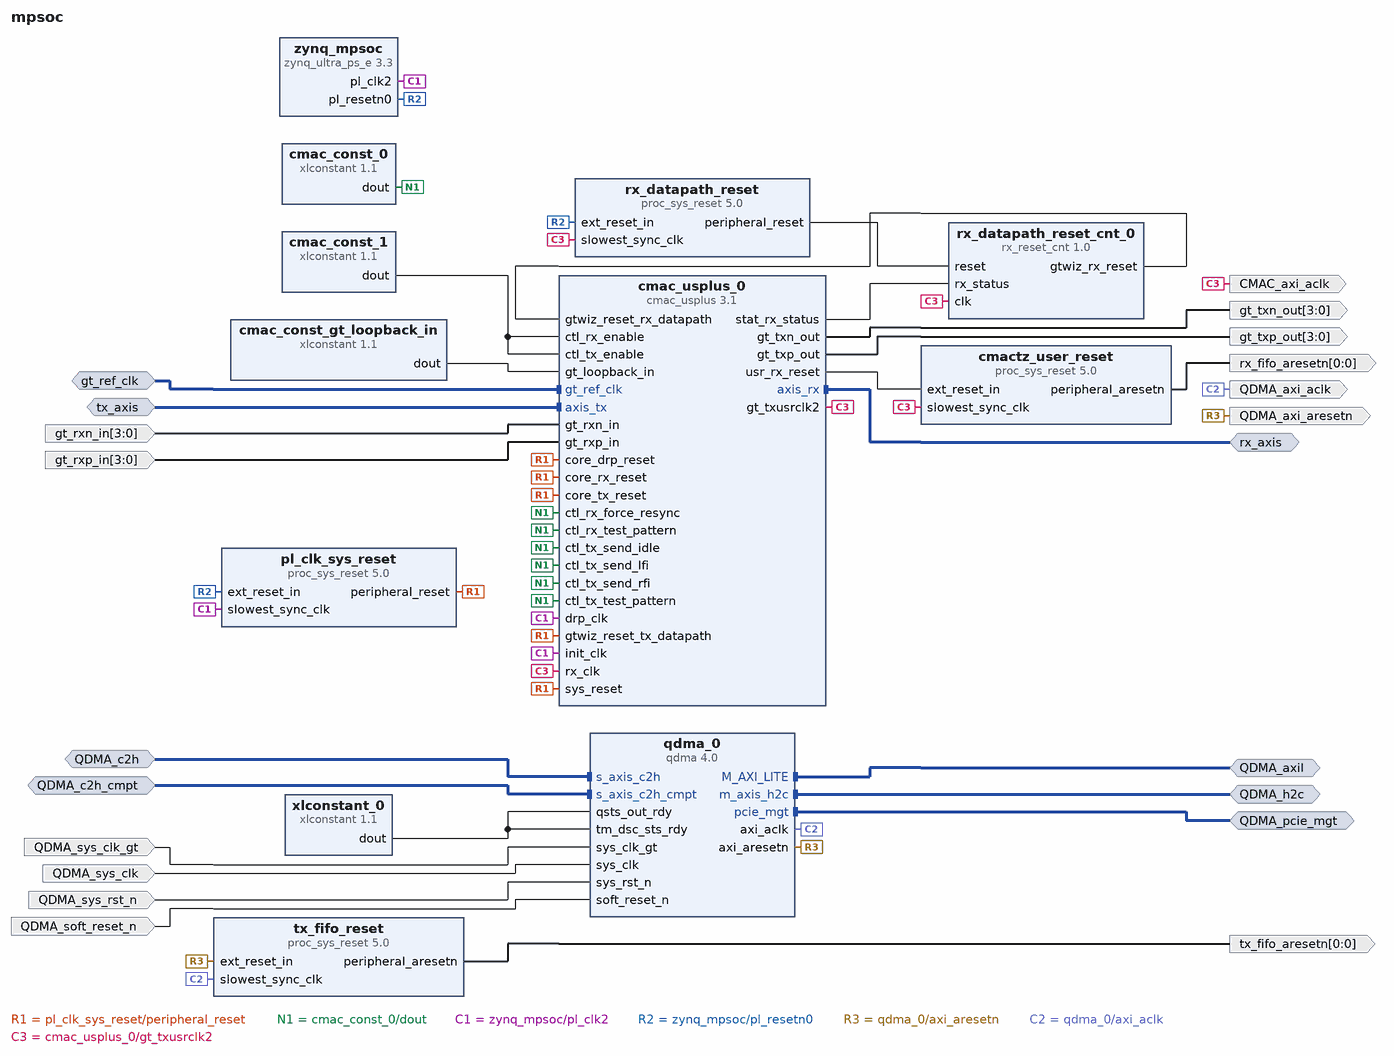
[diagram p0: block diagram of the top level]
# Vivado block design mpsoc, xczu19eg-ffvc1760-2-e, Vivado 2020.1
create_bd_design mpsoc

create_bd_intf_port -mode Slave -vlnv xilinx.com:interface:diff_clock_rtl:1.0 gt_ref_clk
set_property -dict {CONFIG.FREQ_HZ 156250000} [get_bd_intf_ports gt_ref_clk]
create_bd_intf_port -mode Master -vlnv xilinx.com:interface:pcie_7x_mgt_rtl:1.0 QDMA_pcie_mgt
create_bd_intf_port -mode Master -vlnv xilinx.com:display_eqdma:m_axis_h2c_rtl:1.0 QDMA_h2c
create_bd_intf_port -mode Slave -vlnv xilinx.com:display_eqdma:s_axis_c2h_rtl:1.0 QDMA_c2h
create_bd_intf_port -mode Slave -vlnv xilinx.com:display_eqdma:s_axis_c2h_cmpt_rtl:1.0 QDMA_c2h_cmpt
create_bd_intf_port -mode Master -vlnv xilinx.com:interface:aximm_rtl:1.0 QDMA_axil
set_property -dict [list \
  CONFIG.DATA_WIDTH 32 \
  CONFIG.PROTOCOL AXI4LITE \
  CONFIG.FREQ_HZ 250000000 \
  CONFIG.ADDR_WIDTH 32 \
  CONFIG.HAS_BURST 0 \
  CONFIG.HAS_LOCK 0 \
  CONFIG.HAS_CACHE 0 \
  CONFIG.HAS_QOS 0 \
  CONFIG.HAS_REGION 0 \
] [get_bd_intf_ports QDMA_axil]
create_bd_intf_port -mode Master -vlnv xilinx.com:interface:axis_rtl:1.0 rx_axis
set_property -dict {CONFIG.FREQ_HZ 322265625} [get_bd_intf_ports rx_axis]
create_bd_intf_port -mode Slave -vlnv xilinx.com:interface:axis_rtl:1.0 tx_axis
set_property -dict [list \
  CONFIG.TDATA_NUM_BYTES 64 \
  CONFIG.TDEST_WIDTH 0 \
  CONFIG.TID_WIDTH 0 \
  CONFIG.TUSER_WIDTH 1 \
  CONFIG.HAS_TREADY 1 \
  CONFIG.HAS_TSTRB 0 \
  CONFIG.HAS_TKEEP 1 \
  CONFIG.HAS_TLAST 1 \
  CONFIG.LAYERED_METADATA undef \
] [get_bd_intf_ports tx_axis]
create_bd_port -dir I -from 3 -to 0 gt_rxn_in
create_bd_port -dir I -from 3 -to 0 gt_rxp_in
create_bd_port -dir O -from 3 -to 0 gt_txn_out
create_bd_port -dir O -from 3 -to 0 gt_txp_out
create_bd_port -dir I -type clk QDMA_sys_clk_gt
create_bd_port -dir I -type clk QDMA_sys_clk
set_property -dict {CONFIG.ASSOCIATED_RESET QDMA_sys_rst_n} [get_bd_ports QDMA_sys_clk]
create_bd_port -dir I -type rst QDMA_sys_rst_n
create_bd_port -dir O -type rst QDMA_axi_aresetn
create_bd_port -dir O -type clk QDMA_axi_aclk
set_property -dict {CONFIG.ASSOCIATED_BUSIF QDMA_axil CONFIG.FREQ_HZ 250000000} [get_bd_ports QDMA_axi_aclk]
create_bd_port -dir I -type rst QDMA_soft_reset_n
create_bd_port -dir O -type clk CMAC_axi_aclk
set_property -dict {CONFIG.ASSOCIATED_BUSIF tx_axis} [get_bd_ports CMAC_axi_aclk]
create_bd_port -dir O -from 0 -to 0 -type rst rx_fifo_aresetn
create_bd_port -dir O -from 0 -to 0 -type rst tx_fifo_aresetn

create_bd_cell -type ip -vlnv xilinx.com:ip:xlconstant:1.1 cmac_const_0
set_property -dict {CONFIG.CONST_VAL 0} [get_bd_cells cmac_const_0]
create_bd_cell -type ip -vlnv xilinx.com:ip:xlconstant:1.1 cmac_const_1
set_property -dict {CONFIG.CONST_VAL 1} [get_bd_cells cmac_const_1]
create_bd_cell -type ip -vlnv xilinx.com:ip:xlconstant:1.1 cmac_const_gt_loopback_in
set_property -dict {CONFIG.CONST_VAL 0 CONFIG.CONST_WIDTH 12} [get_bd_cells cmac_const_gt_loopback_in]
create_bd_cell -type ip -vlnv xilinx.com:ip:cmac_usplus:3.1 cmac_usplus_0
set_property -dict [list \
  CONFIG.CMAC_CAUI4_MODE 1 \
  CONFIG.CMAC_CORE_SELECT CMACE4_X0Y1 \
  CONFIG.ENABLE_AXI_INTERFACE 0 \
  CONFIG.GT_GROUP_SELECT {X0Y12~X0Y15} \
  CONFIG.GT_REF_CLK_FREQ 156.25 \
  CONFIG.NUM_LANES 4x25 \
  CONFIG.RX_FLOW_CONTROL 0 \
  CONFIG.RX_FRAME_CRC_CHECKING {Enable FCS Stripping} \
  CONFIG.RX_MAX_PACKET_LEN 2048 \
  CONFIG.TX_FLOW_CONTROL 0 \
  CONFIG.TX_FRAME_CRC_CHECKING {Enable FCS Insertion} \
  CONFIG.USER_INTERFACE AXIS \
] [get_bd_cells cmac_usplus_0]
create_bd_cell -type ip -vlnv xilinx.com:ip:proc_sys_reset:5.0 pl_clk_sys_reset
create_bd_cell -type ip -vlnv xilinx.com:ip:proc_sys_reset:5.0 rx_datapath_reset
create_bd_cell -type ip -vlnv user.org:user:rx_reset_cnt:1.0 rx_datapath_reset_cnt_0
create_bd_cell -type ip -vlnv xilinx.com:ip:proc_sys_reset:5.0 cmactz_user_reset
create_bd_cell -type ip -vlnv xilinx.com:ip:zynq_ultra_ps_e:3.3 zynq_mpsoc
set_property -dict [list \
  CONFIG.PSU_BANK_0_IO_STANDARD LVCMOS33 \
  CONFIG.PSU_BANK_1_IO_STANDARD LVCMOS33 \
  CONFIG.PSU_BANK_2_IO_STANDARD LVCMOS33 \
  CONFIG.PSU__CRF_APB__DDR_CTRL__FREQMHZ 1067 \
  CONFIG.PSU__CRL_APB__PL2_REF_CTRL__SRCSEL DPLL \
  CONFIG.PSU__DDRC__COMPONENTS UDIMM \
  CONFIG.PSU__DDRC__DEVICE_CAPACITY {8192 MBits} \
  CONFIG.PSU__DDRC__SPEED_BIN DDR4_2133P \
  CONFIG.PSU__DDR_HIGH_ADDRESS_GUI_ENABLE 1 \
  CONFIG.PSU__DDR__INTERFACE__FREQMHZ 533.500 \
  CONFIG.PSU__DLL__ISUSED 1 \
  CONFIG.PSU__ENET0__GRP_MDIO__ENABLE 1 \
  CONFIG.PSU__ENET0__GRP_MDIO__IO {MIO 76 .. 77} \
  CONFIG.PSU__ENET0__PERIPHERAL__ENABLE 1 \
  CONFIG.PSU__ENET0__PERIPHERAL__IO {MIO 26 .. 37} \
  CONFIG.PSU__ENET1__PERIPHERAL__ENABLE 1 \
  CONFIG.PSU__ENET1__PERIPHERAL__IO {GT Lane1} \
  CONFIG.PSU__EXPAND__LOWER_LPS_SLAVES 1 \
  CONFIG.PSU__FPGA_PL0_ENABLE 0 \
  CONFIG.PSU__FPGA_PL2_ENABLE 1 \
  CONFIG.PSU__GEM1__REF_CLK_FREQ 125 \
  CONFIG.PSU__GEM1__REF_CLK_SEL {Ref Clk1} \
  CONFIG.PSU__GEM__TSU__ENABLE 0 \
  CONFIG.PSU__OVERRIDE__BASIC_CLOCK 0 \
  CONFIG.PSU__PSS_REF_CLK__FREQMHZ 50 \
  CONFIG.PSU__QSPI_COHERENCY 0 \
  CONFIG.PSU__QSPI_ROUTE_THROUGH_FPD 0 \
  CONFIG.PSU__QSPI__GRP_FBCLK__ENABLE 0 \
  CONFIG.PSU__QSPI__PERIPHERAL__DATA_MODE x4 \
  CONFIG.PSU__QSPI__PERIPHERAL__ENABLE 1 \
  CONFIG.PSU__QSPI__PERIPHERAL__IO {MIO 0 .. 12} \
  CONFIG.PSU__QSPI__PERIPHERAL__MODE {Dual Parallel} \
  CONFIG.PSU__SD0__DATA_TRANSFER_MODE 4Bit \
  CONFIG.PSU__SD0__PERIPHERAL__ENABLE 1 \
  CONFIG.PSU__SD0__PERIPHERAL__IO {MIO 13 .. 16 21 22} \
  CONFIG.PSU__SD0__SLOT_TYPE {SD 2.0} \
  CONFIG.PSU__TSU__BUFG_PORT_PAIR 0 \
  CONFIG.PSU__UART0__BAUD_RATE 115200 \
  CONFIG.PSU__UART0__MODEM__ENABLE 0 \
  CONFIG.PSU__UART0__PERIPHERAL__ENABLE 1 \
  CONFIG.PSU__UART0__PERIPHERAL__IO {MIO 46 .. 47} \
  CONFIG.PSU__USE__IRQ0 1 \
  CONFIG.PSU__USE__M_AXI_GP0 0 \
  CONFIG.PSU__USE__M_AXI_GP1 0 \
  CONFIG.PSU__USE__M_AXI_GP2 0 \
  CONFIG.SUBPRESET1 Custom \
] [get_bd_cells zynq_mpsoc]
# 69 more settings of zynq_mpsoc are not shown: defaults, MIO pin electricals, DDR timing, and values the tool derives
create_bd_cell -type ip -vlnv xilinx.com:ip:qdma:4.0 qdma_0
set_property -dict [list \
  CONFIG.dma_intf_sel_qdma AXI_Stream_with_Completion \
  CONFIG.en_axi_mm_qdma false \
  CONFIG.en_axi_st_qdma true \
  CONFIG.num_queues 2048 \
  CONFIG.pcie_blk_locn X1Y0 \
  CONFIG.pf3_subsystem_id 0007 \
  CONFIG.testname st \
  CONFIG.tl_pf_enable_reg 1 \
] [get_bd_cells qdma_0]
create_bd_cell -type ip -vlnv xilinx.com:ip:proc_sys_reset:5.0 tx_fifo_reset
create_bd_cell -type ip -vlnv xilinx.com:ip:xlconstant:1.1 xlconstant_0

# ---- connections ----

connect_bd_intf_net [get_bd_intf_ports QDMA_h2c] [get_bd_intf_pins qdma_0/m_axis_h2c]
connect_bd_intf_net -intf_net gt_ref_clk_0_1 [get_bd_intf_ports gt_ref_clk] [get_bd_intf_pins cmac_usplus_0/gt_ref_clk]
connect_bd_intf_net [get_bd_intf_ports QDMA_axil] [get_bd_intf_pins qdma_0/M_AXI_LITE]
connect_bd_intf_net [get_bd_intf_ports rx_axis] [get_bd_intf_pins cmac_usplus_0/axis_rx]
connect_bd_intf_net -intf_net s_axis_c2h_0_1 [get_bd_intf_ports QDMA_c2h] [get_bd_intf_pins qdma_0/s_axis_c2h]
connect_bd_intf_net -intf_net axis_tx_0_1 [get_bd_intf_ports tx_axis] [get_bd_intf_pins cmac_usplus_0/axis_tx]
connect_bd_intf_net [get_bd_intf_ports QDMA_pcie_mgt] [get_bd_intf_pins qdma_0/pcie_mgt]
connect_bd_intf_net -intf_net s_axis_c2h_cmpt_0_1 [get_bd_intf_ports QDMA_c2h_cmpt] [get_bd_intf_pins qdma_0/s_axis_c2h_cmpt]
connect_bd_net -net axi_ic_if_reset [get_bd_pins pl_clk_sys_reset/peripheral_reset] \
  [get_bd_pins cmac_usplus_0/core_drp_reset] [get_bd_pins cmac_usplus_0/core_rx_reset] \
  [get_bd_pins cmac_usplus_0/core_tx_reset] [get_bd_pins cmac_usplus_0/gtwiz_reset_tx_datapath] \
  [get_bd_pins cmac_usplus_0/sys_reset]
connect_bd_net [get_bd_pins cmac_usplus_0/gt_txn_out] [get_bd_ports gt_txn_out]
connect_bd_net [get_bd_pins cmac_usplus_0/gt_txp_out] [get_bd_ports gt_txp_out]
connect_bd_net [get_bd_pins cmac_usplus_0/usr_rx_reset] [get_bd_pins cmactz_user_reset/ext_reset_in]
connect_bd_net -net const_0_dout [get_bd_pins cmac_const_0/dout] \
  [get_bd_pins cmac_usplus_0/ctl_rx_force_resync] [get_bd_pins cmac_usplus_0/ctl_rx_test_pattern] \
  [get_bd_pins cmac_usplus_0/ctl_tx_send_idle] [get_bd_pins cmac_usplus_0/ctl_tx_send_lfi] \
  [get_bd_pins cmac_usplus_0/ctl_tx_send_rfi] [get_bd_pins cmac_usplus_0/ctl_tx_test_pattern]
connect_bd_net -net const_1_dout [get_bd_pins cmac_const_1/dout] [get_bd_pins cmac_usplus_0/ctl_rx_enable] [get_bd_pins cmac_usplus_0/ctl_tx_enable]
connect_bd_net -net const_gt_loopback_in_dout [get_bd_pins cmac_const_gt_loopback_in/dout] [get_bd_pins cmac_usplus_0/gt_loopback_in]
connect_bd_net -net doce_ic_reset_peripheral_reset [get_bd_pins rx_datapath_reset/peripheral_reset] [get_bd_pins rx_datapath_reset_cnt_0/reset]
connect_bd_net [get_bd_ports gt_rxn_in] [get_bd_pins cmac_usplus_0/gt_rxn_in]
connect_bd_net [get_bd_ports gt_rxp_in] [get_bd_pins cmac_usplus_0/gt_rxp_in]
connect_bd_net -net pl_clk2_out [get_bd_pins zynq_mpsoc/pl_clk2] \
  [get_bd_pins cmac_usplus_0/drp_clk] [get_bd_pins cmac_usplus_0/init_clk] [get_bd_pins pl_clk_sys_reset/slowest_sync_clk]
connect_bd_net -net pl_resetn0 [get_bd_pins zynq_mpsoc/pl_resetn0] \
  [get_bd_pins pl_clk_sys_reset/ext_reset_in] [get_bd_pins rx_datapath_reset/ext_reset_in]
connect_bd_net -net rx_reset_cnt_0_gtwiz_rx_reset [get_bd_pins rx_datapath_reset_cnt_0/gtwiz_rx_reset] \
  [get_bd_pins cmac_usplus_0/gtwiz_reset_rx_datapath]
connect_bd_net -net sys_clk_gt_0_1 [get_bd_ports QDMA_sys_clk_gt] [get_bd_pins qdma_0/sys_clk_gt]
connect_bd_net -net sys_clk_0_1 [get_bd_ports QDMA_sys_clk] [get_bd_pins qdma_0/sys_clk]
connect_bd_net -net sys_rst_n_0_1 [get_bd_ports QDMA_sys_rst_n] [get_bd_pins qdma_0/sys_rst_n]
connect_bd_net [get_bd_pins qdma_0/axi_aresetn] [get_bd_ports QDMA_axi_aresetn] [get_bd_pins tx_fifo_reset/ext_reset_in]
connect_bd_net [get_bd_pins qdma_0/axi_aclk] [get_bd_ports QDMA_axi_aclk] [get_bd_pins tx_fifo_reset/slowest_sync_clk]
connect_bd_net -net tx_reset_peripheral_aresetn [get_bd_pins cmactz_user_reset/peripheral_aresetn] [get_bd_ports rx_fifo_aresetn]
connect_bd_net -net soft_reset_n_0_1 [get_bd_ports QDMA_soft_reset_n] [get_bd_pins qdma_0/soft_reset_n]
connect_bd_net [get_bd_pins cmac_usplus_0/gt_txusrclk2] \
  [get_bd_pins cmac_usplus_0/rx_clk] [get_bd_pins rx_datapath_reset/slowest_sync_clk] \
  [get_bd_pins cmactz_user_reset/slowest_sync_clk] [get_bd_pins rx_datapath_reset_cnt_0/clk] [get_bd_ports CMAC_axi_aclk]
connect_bd_net -net rx_datapath_reset1_peripheral_aresetn [get_bd_pins tx_fifo_reset/peripheral_aresetn] [get_bd_ports tx_fifo_aresetn]
connect_bd_net [get_bd_pins xlconstant_0/dout] [get_bd_pins qdma_0/qsts_out_rdy] [get_bd_pins qdma_0/tm_dsc_sts_rdy]
connect_bd_net [get_bd_pins cmac_usplus_0/stat_rx_status] [get_bd_pins rx_datapath_reset_cnt_0/rx_status]

# ---- address map ----
assign_bd_address -offset 0x44A00000 -range 64K -target_address_space [get_bd_addr_spaces qdma_0/M_AXI_LITE] [get_bd_addr_segs QDMA_axil/Reg]

validate_bd_design
save_bd_design
